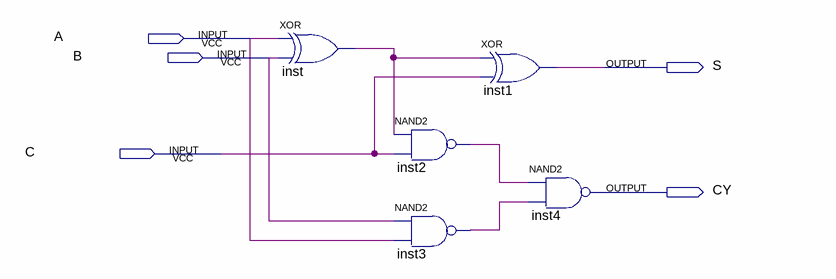
[diagram p0: schematic sheet]
// Quartus schematic FullAdd.bdf as structural Verilog: 5 symbols, 5 pins
module FullAdd (
  input  A,
  input  B,
  input  C,
  output S,
  output CY
);

  wire inst2_out, inst3_out, inst_out;

  xor inst (inst_out, A, B);
  nand inst2 (inst2_out, inst_out, C);
  nand inst3 (inst3_out, B, A);
  xor inst1 (S, inst_out, C);
  nand inst4 (CY, inst2_out, inst3_out);
endmodule
